# Altium schematic sheet Part16_I2C_MPU9250.SchDoc
size A4
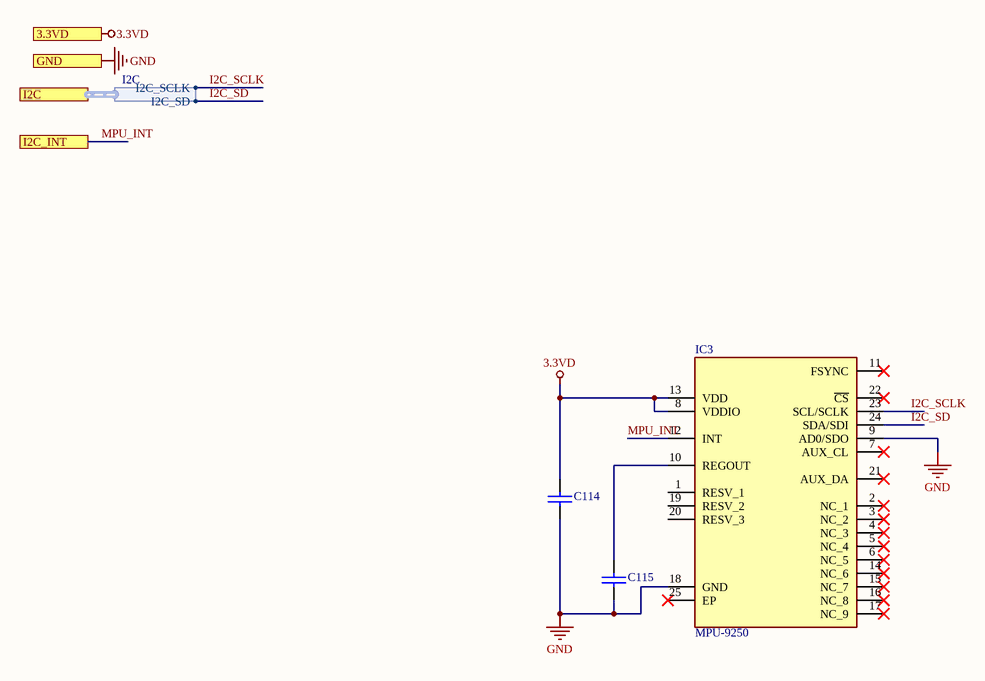
[diagram p0: Part16_I2C_MPU9250.SchDoc]

## Parts
C114  100nF  [0402C]  (value not drawn)
C115  100nF  [0402C]  (value not drawn)
IC3  MPU-9250  [QFN40P300X300X105-25N-D]

## Ports
3.3VD, GND, I2C (harness I2C), I2C_INT

## Harnesses
I2C: I2C_SCLK, I2C_SD

## Nets
3.3VD: C114.1 IC3.8(VDDIO) IC3.13(VDD) ; port 3.3VD
GND: C114.2 C115.2 IC3.9(AD0/SDO) IC3.18(GND) ; port GND
I2C_SCLK: IC3.23(SCL/SCLK) ; port I2C.I2C_SCLK
I2C_SD: IC3.24(SDA/SDI) ; port I2C.I2C_SD
MPU_INT: IC3.12(INT) ; port I2C_INT
NetC115_1: C115.1 IC3.10(REGOUT)

Not connected (* = marked no-connect by the designer): IC3 1(RESV_1) 2(NC_1)* 3(NC_2)* 4(NC_3)* 5(NC_4)* 6(NC_5)* 7(AUX_CL)* 11(FSYNC)* 14(NC_6)* 15(NC_7)* 16(NC_8)* 17(NC_9)* 19(RESV_2) 20(RESV_3) 21(AUX_DA)* 22(~{CS})* 25(EP)*

## Library data of the parts
C114 C115 = CAP: 无极性电容
IC3 = MPU-9250: Integrated Circuit; Manufacturer_Name: InvenSense Inc.; Datasheet Link: https://store.invensense.com/datasheets/invensense/MPU9250REV1.0.pdf; Height: 1.05mm; Manufacturer_Part_Number: MPU-9250; Arrow Part Number: MPU-9250; Mouser Part Number: 410-MPU-9250; Mouser Price/Stock: https://www.mouser.co.uk/ProductDetail/TDK-InvenSense/MPU-9250?qs=u4fy%2FsgLU9OhGjFkQSZssA%3D%3D